# EAGLE design car_onboard (EAGLE 9.6.2)
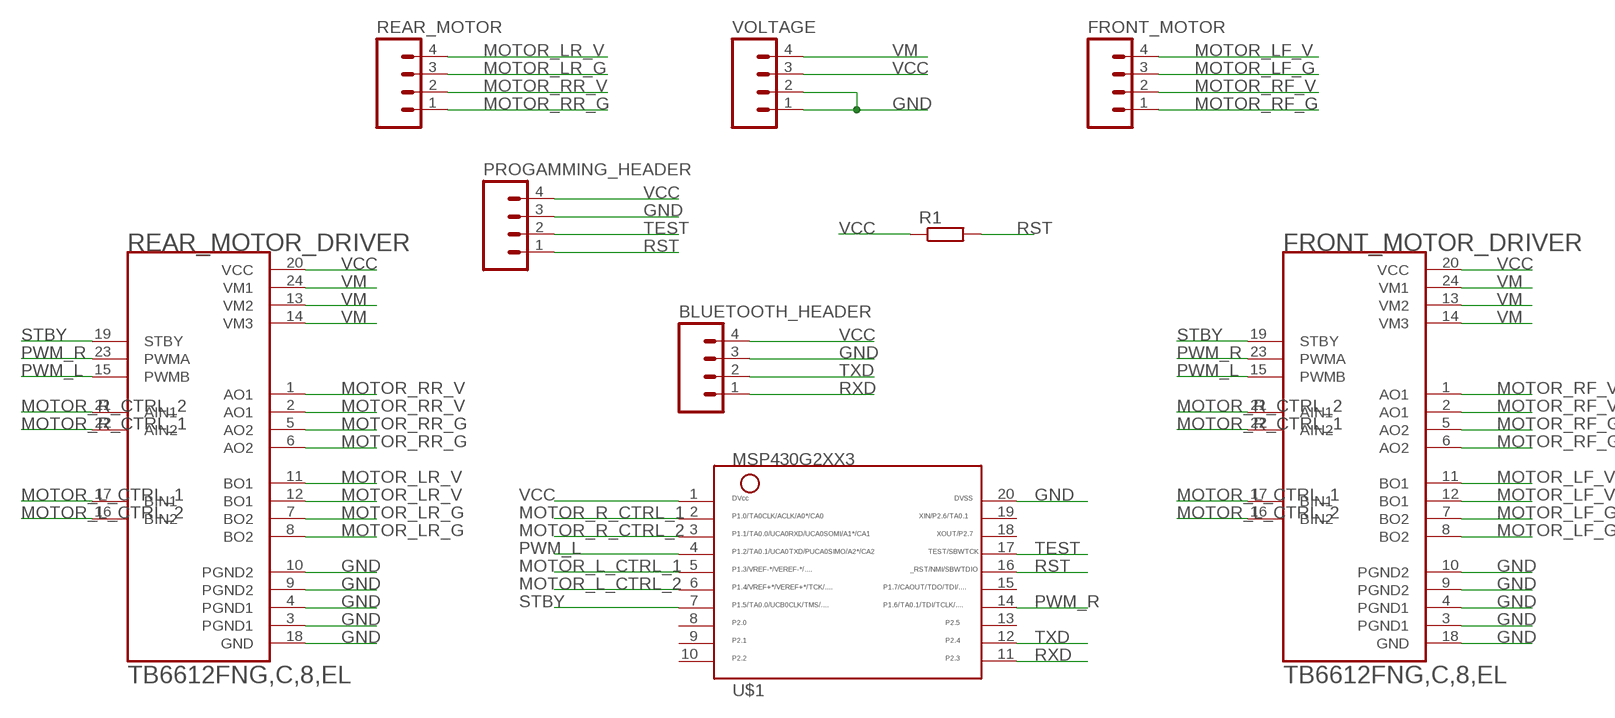
[diagram p0: schematic, sheet 1]

## Parts
BLUETOOTH_HEADER  HEADER_1X04LOCK  [1X04_LOCK]
FRONT_MOTOR  HEADER_1X04LOCK  [1X04_LOCK]
FRONT_MOTOR_DRIVER  TB6612FNG,C,8,EL  [SOP65P760X160-24N]
PROGAMMING_HEADER  HEADER_1X04LOCK  [1X04_LOCK]
R1  R-EU_R1206  [R1206]
REAR_MOTOR  HEADER_1X04LOCK  [1X04_LOCK]
REAR_MOTOR_DRIVER  TB6612FNG,C,8,EL  [SOP65P760X160-24N]
U$1  MSP430G2XX3TSSOP  [PW20]
VOLTAGE  HEADER_1X04LOCK  [1X04_LOCK]

## Nets
GND: BLUETOOTH_HEADER.3 FRONT_MOTOR_DRIVER.3(PGND1) FRONT_MOTOR_DRIVER.4(PGND1) FRONT_MOTOR_DRIVER.9(PGND2) FRONT_MOTOR_DRIVER.10(PGND2) FRONT_MOTOR_DRIVER.18(GND) PROGAMMING_HEADER.3 REAR_MOTOR_DRIVER.3(PGND1) REAR_MOTOR_DRIVER.4(PGND1) REAR_MOTOR_DRIVER.9(PGND2) REAR_MOTOR_DRIVER.10(PGND2) REAR_MOTOR_DRIVER.18(GND) U$1.20 VOLTAGE.1 VOLTAGE.2
MOTOR_L_CTRL_1: FRONT_MOTOR_DRIVER.17(BIN1) REAR_MOTOR_DRIVER.17(BIN1) U$1.5
MOTOR_L_CTRL_2: FRONT_MOTOR_DRIVER.16(BIN2) REAR_MOTOR_DRIVER.16(BIN2) U$1.6
MOTOR_LF_G: FRONT_MOTOR.3 FRONT_MOTOR_DRIVER.7(BO2) FRONT_MOTOR_DRIVER.8(BO2)
MOTOR_LF_V: FRONT_MOTOR.4 FRONT_MOTOR_DRIVER.11(BO1) FRONT_MOTOR_DRIVER.12(BO1)
MOTOR_LR_G: REAR_MOTOR.3 REAR_MOTOR_DRIVER.7(BO2) REAR_MOTOR_DRIVER.8(BO2)
MOTOR_LR_V: REAR_MOTOR.4 REAR_MOTOR_DRIVER.11(BO1) REAR_MOTOR_DRIVER.12(BO1)
MOTOR_R_CTRL_1: FRONT_MOTOR_DRIVER.22(AIN2) REAR_MOTOR_DRIVER.22(AIN2) U$1.2
MOTOR_R_CTRL_2: FRONT_MOTOR_DRIVER.21(AIN1) REAR_MOTOR_DRIVER.21(AIN1) U$1.3
MOTOR_RF_G: FRONT_MOTOR.1 FRONT_MOTOR_DRIVER.5(AO2) FRONT_MOTOR_DRIVER.6(AO2)
MOTOR_RF_V: FRONT_MOTOR.2 FRONT_MOTOR_DRIVER.1(AO1) FRONT_MOTOR_DRIVER.2(AO1)
MOTOR_RR_G: REAR_MOTOR.1 REAR_MOTOR_DRIVER.5(AO2) REAR_MOTOR_DRIVER.6(AO2)
MOTOR_RR_V: REAR_MOTOR.2 REAR_MOTOR_DRIVER.1(AO1) REAR_MOTOR_DRIVER.2(AO1)
PWM_L: FRONT_MOTOR_DRIVER.15(PWMB) REAR_MOTOR_DRIVER.15(PWMB) U$1.4
PWM_R: FRONT_MOTOR_DRIVER.23(PWMA) REAR_MOTOR_DRIVER.23(PWMA) U$1.14
RST: PROGAMMING_HEADER.1 R1.2 U$1.16
RXD: BLUETOOTH_HEADER.1 U$1.11
STBY: FRONT_MOTOR_DRIVER.19(STBY) REAR_MOTOR_DRIVER.19(STBY) U$1.7
TEST: PROGAMMING_HEADER.2 U$1.17
TXD: BLUETOOTH_HEADER.2 U$1.12
VCC: BLUETOOTH_HEADER.4 FRONT_MOTOR_DRIVER.20(VCC) PROGAMMING_HEADER.4 R1.1 REAR_MOTOR_DRIVER.20(VCC) U$1.1 VOLTAGE.3
VM: FRONT_MOTOR_DRIVER.13(VM2) FRONT_MOTOR_DRIVER.14(VM3) FRONT_MOTOR_DRIVER.24(VM1) REAR_MOTOR_DRIVER.13(VM2) REAR_MOTOR_DRIVER.14(VM3) REAR_MOTOR_DRIVER.24(VM1) VOLTAGE.4
Unconnected: U$1.8 U$1.9 U$1.10 U$1.13 U$1.15 U$1.18 U$1.19

## Library data of the parts
BLUETOOTH_HEADER FRONT_MOTOR PROGAMMING_HEADER REAR_MOTOR VOLTAGE = ELEC327:HEADER_1X04: Header 4 Standard 4-pin 0.1" header. Use with straight break away headers (SKU : PRT-00116), right angle break away headers (PRT-00553), swiss pins (PRT-00743), machine pins (PRT-00117), and female headers (PRT-00115). Molex polarized connector foot print use with SKU : PRT-08231 with associated crimp pins and housings.
FRONT_MOTOR_DRIVER REAR_MOTOR_DRIVER = TB6612FNG_C_8_EL:TB6612FNG,C,8,EL: Stepping Motor Driver Ic Unipolor Copper Wire 8" Check availability <https://pricing.snapeda.com/parts/TB6612FNG%2CC%2C8%2CEL/Toshiba/view-part?ref=eda>; AVAILABILITY: In Stock; DESCRIPTION: - Motor Driver Power MOSFET Parallel 24-SSOP; MF: Toshiba; MP: TB6612FNG,C,8,EL; PACKAGE: SSOP-24 Toshiba; PRICE: None; PURCHASE-URL: https://pricing.snapeda.com/search/part/TB6612FNG,C,8,EL/?ref=eda
R1 = rcl:R-EU_: RESISTOR, European symbol; SPICEPREFIX: R
U$1 = ELEC327:MSP430G2XX3: MSP430G2XX3 PDIP (N) 20 Pin Package

## Board
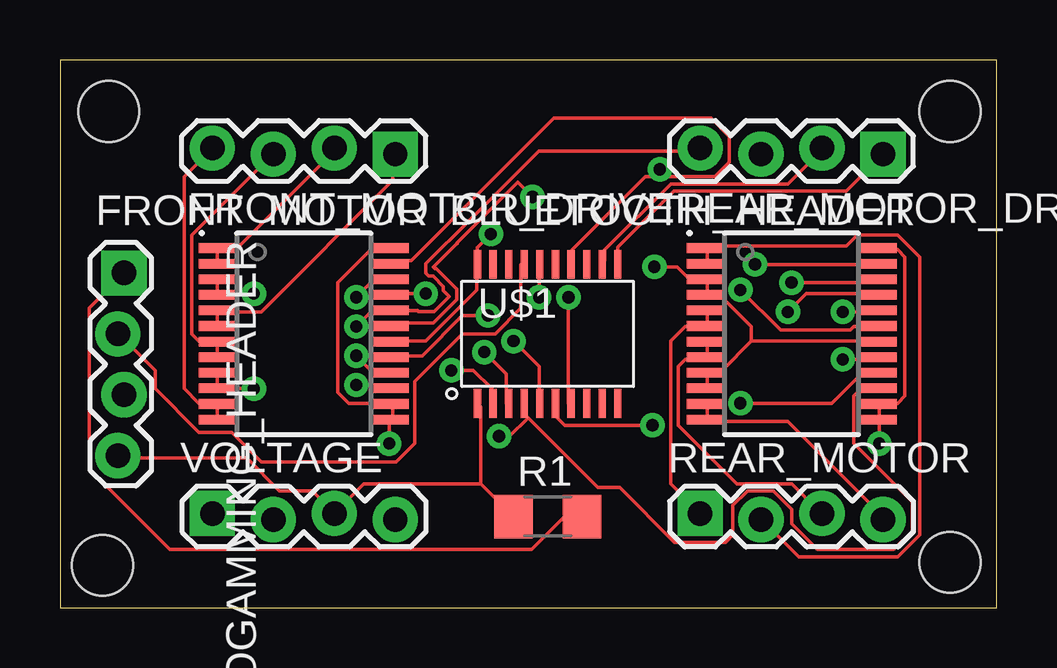
[diagram p1: board, top side]
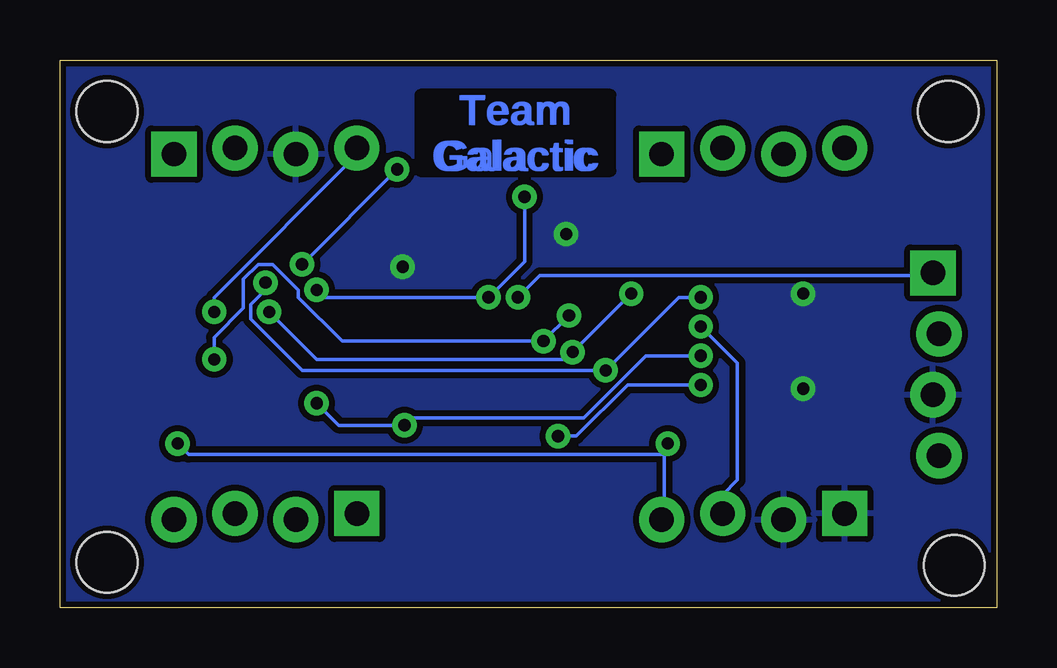
[diagram p2: board, bottom side, seen from below]

Size 39.04 x 22.85 mm. Coordinates in mm from the lower left corner, seen from the top.
Outline: 0,0 39.04,0 39.04,22.85 0,22.85 0,0
Copper layers (1*16): Top 0.035mm / dielectric 1.5mm / Bottom 0.035mm
Design rules "AdvancedCircuitsBarebones": minimum track width 6mil, minimum drill 20mil, track to track 6mil, track to pad 6mil, pad to pad 6mil, via to via 6mil, smd to smd 6mil, copper to edge 10mil, drill to drill 6mil, minimum pad ring 12mil, minimum via ring 10mil, stop-mask expansion 4mil, vias tented up to drill 25mil, thermal gap 10mil
Holes 2.54 mm at 37.08,20.7 37.08,1.91 1.78,1.78 2.03,20.7

### Footprints (pad centres in the part's own frame; a part is rotated, then mirrored left to right if it is on the bottom)
1X04_LOCK = drill 1.016 pad 1.88 square: 1 0,0.127 | drill 1.016 pad 1.88: 2 2.54,-0.127; 3 5.08,0.127; 4 7.62,-0.127
SOP65P760X160-24N = smd 1.5 x 0.4: 1 -3.625,3.575; 2 -3.625,2.925; 3 -3.625,2.275; 4 -3.625,1.625; 5 -3.625,0.975; 6 -3.625,0.325; 7 -3.625,-0.325; 8 -3.625,-0.975; 9 -3.625,-1.625; 10 -3.625,-2.275; 11 -3.625,-2.925; 12 -3.625,-3.575; 13 3.625,-3.575; 14 3.625,-2.925; 15 3.625,-2.275; 16 3.625,-1.625; 17 3.625,-0.975; 18 3.625,-0.325; 19 3.625,0.325; 20 3.625,0.975; 21 3.625,1.625; 22 3.625,2.275; 23 3.625,2.925; 24 3.625,3.575
R1206 = smd 1.6 x 1.803: 1 -1.422,0; 2 1.422,0
PW20 = smd 0.3 x 1.2: 1 -2.925,-2.9; 2 -2.275,-2.9; 3 -1.625,-2.9; 4 -0.975,-2.9; 5 -0.325,-2.9; 6 0.325,-2.9; 7 0.975,-2.9; 8 1.625,-2.9; 9 2.275,-2.9; 10 2.925,-2.9; 11 2.925,2.9; 12 2.275,2.9; 13 1.625,2.9; 14 0.975,2.9; 15 0.325,2.9; 16 -0.325,2.9; 17 -0.975,2.9; 18 -1.625,2.9; 19 -2.275,2.9; 20 -2.925,2.9

### Placement (x,y rotation side)
BLUETOOTH_HEADER  34.29,19.05 180 top
FRONT_MOTOR  13.97,19.05 180 top
FRONT_MOTOR_DRIVER  10.16,11.43 0 top
PROGAMMING_HEADER  2.54,13.97 270 top
R1  20.32,3.81 0 top
REAR_MOTOR  26.67,3.81 0 top
REAR_MOTOR_DRIVER  30.48,11.43 0 top
U$1  20.32,11.43 0 top
VOLTAGE  6.35,3.81 0 top

### Tracks (layer width: path | path; a pad name or v marks a point on that pad's centre or on a via)
GND  (via drill 0.51)
  Top 0.152: REAR_MOTOR_DRIVER.10 26.98,9.3 26.98,9.75 REAR_MOTOR_DRIVER.9 26.98,9.91 27.58,9.91 28.8,11.12 | 28.8,11.12 33.98,11.12 REAR_MOTOR_DRIVER.18 | 28.8,11.12 28.8,11.73 27.58,12.95 26.98,12.95 REAR_MOTOR_DRIVER.4 26.98,13.11 26.98,13.56 REAR_MOTOR_DRIVER.3 26.82,13.67 26.26,13.67 25.71,14.22 v24.77,14.22 | 6.55,13.11 6.55,13.56 FRONT_MOTOR_DRIVER.3 | FRONT_MOTOR_DRIVER.9 6.55,9.75 6.55,9.3 FRONT_MOTOR_DRIVER.10 6.55,9.14 v8.08,9.14 | v8.08,13.11 6.55,13.11 | 6.55,13.11 FRONT_MOTOR_DRIVER.4 | FRONT_MOTOR_DRIVER.18 13.87,11.12 15.24,11.12 17.37,13.26 17.37,14.33 U$1.20 17.39,15.03 v17.95,15.59
  pour Bottom (isolate 0.254): 0,26.67 40.64,26.67 41.91,25.4 41.91,-3.81 40.64,-5.08 0,-5.08
MOTOR_L_CTRL_1  (via drill 0.51)
  Top 0.152: v18.9,11.12 19.96,10.06 19.96,8.53 U$1.5 | v17.83,12.19 16.76,12.19 15.09,10.52 13.87,10.52 FRONT_MOTOR_DRIVER.17 | v32.61,10.36 33.98,10.36 REAR_MOTOR_DRIVER.17
  Bottom 0.152: v17.83,12.19 v18.9,11.12 27.28,11.12 29.11,12.95 29.11,13.26 30.18,14.33 30.79,14.33 31.39,13.72 31.39,12.5 32.61,11.28 v32.61,10.36
MOTOR_L_CTRL_2  (via drill 0.51)
  Top 0.152: v24.69,7.62 21.03,7.62 20.73,7.92 20.73,8.38 U$1.6 | v28.35,8.53 32.16,8.53 33.38,9.75 33.98,9.75 REAR_MOTOR_DRIVER.16 | v12.34,10.52 12.95,9.91 13.72,9.91 FRONT_MOTOR_DRIVER.16
  Bottom 0.152: v28.35,8.53 27.43,7.62 v24.69,7.62 24.38,7.92 17.22,7.92 14.63,10.52 v12.34,10.52
MOTOR_LF_G
  Top 0.152: FRONT_MOTOR_DRIVER.8 6.55,10.52 6.55,10.97 FRONT_MOTOR_DRIVER.7 6.4,11.12 5.79,11.12 5.49,11.43 5.49,15.54 8.84,18.9 FRONT_MOTOR.3
MOTOR_LF_V
  Top 0.152: FRONT_MOTOR_DRIVER.12 6.55,7.92 6.55,8.38 FRONT_MOTOR_DRIVER.11 6.4,8.53 5.79,8.53 5.18,9.14 5.18,17.98 6.25,19.05 FRONT_MOTOR.4
MOTOR_LR_G
  Top 0.152: REAR_MOTOR_DRIVER.7 26.98,10.97 26.98,10.52 REAR_MOTOR_DRIVER.8 26.82,10.36 26.06,10.36 25.76,10.06 25.76,7.62 28.19,5.18 30.48,5.18 31.7,3.96 REAR_MOTOR.3
MOTOR_LR_V
  Top 0.152: REAR_MOTOR_DRIVER.11 26.98,8.38 26.98,7.92 REAR_MOTOR_DRIVER.12 26.98,7.77 30.33,7.77 34.29,3.81 REAR_MOTOR.4
MOTOR_R_CTRL_1  (via drill 0.51)
  Top 0.152: v16.31,9.91 17.22,9.91 17.98,9.14 17.98,8.53 U$1.2 | v12.34,12.95 12.95,13.56 13.72,13.56 FRONT_MOTOR_DRIVER.22 | v30.48,13.56 33.98,13.56 REAR_MOTOR_DRIVER.22
  Bottom 0.152: v12.34,12.95 13.26,12.95 v16.31,9.91 28.96,9.91 31.09,12.04 31.09,12.65 30.48,13.26 v30.48,13.56
MOTOR_R_CTRL_2  (via drill 0.51)
  Top 0.152: v17.68,10.67 18.59,9.75 18.59,8.53 U$1.3 | v15.24,13.11 13.87,13.11 FRONT_MOTOR_DRIVER.21 | v30.33,12.34 31.09,13.11 33.98,13.11 REAR_MOTOR_DRIVER.21
  Bottom 0.152: v15.24,13.11 v17.68,10.67 17.98,10.36 28.35,10.36 v30.33,12.34
MOTOR_RF_G
  Top 0.152: 6.55,12.34 6.55,11.89 FRONT_MOTOR_DRIVER.6 | 6.55,12.34 8.38,12.34 13.87,17.83 13.87,18.9 FRONT_MOTOR.1 | 6.55,12.34 FRONT_MOTOR_DRIVER.5
MOTOR_RF_V
  Top 0.152: FRONT_MOTOR_DRIVER.2 6.55,14.48 6.55,14.94 FRONT_MOTOR_DRIVER.1 6.55,15.09 7.47,15.09 11.43,19.05 FRONT_MOTOR.2
MOTOR_RR_G
  Top 0.152: REAR_MOTOR_DRIVER.5 26.98,12.34 26.98,11.89 REAR_MOTOR_DRIVER.6 26.82,11.73 26.06,11.73 25.45,11.12 25.45,5.18 26.67,3.96 REAR_MOTOR.1
MOTOR_RR_V
  Top 0.152: REAR_MOTOR_DRIVER.2 26.98,14.48 26.98,14.94 REAR_MOTOR_DRIVER.1 26.98,15.09 32.77,15.09 33.22,15.54 34.9,15.54 35.81,14.63 35.81,3.05 34.9,2.13 30.79,2.13 29.26,3.66 REAR_MOTOR.2
PWM_L  (via drill 0.51)
  Top 0.152: 19.51,7.92 22.4,5.03 23.32,5.03 25.6,2.74 27.74,2.74 28.04,3.05 28.04,4.27 28.65,4.88 29.72,4.88 30.48,4.12 30.48,3.5 31.55,2.44 34.75,2.44 35.51,3.2 35.51,4.42 33.07,6.86 33.07,8.84 33.38,9.14 33.98,9.14 REAR_MOTOR_DRIVER.15 | 19.51,7.92 19.36,8.08 19.36,8.38 U$1.4 | v12.34,9.3 13.72,9.3 FRONT_MOTOR_DRIVER.15 | v18.29,7.16 18.75,7.16 19.51,7.92
  Bottom 0.152: v12.34,9.3 15.39,9.3 17.53,7.16 v18.29,7.16
PWM_R  (via drill 0.51)
  Top 0.152: 24.99,17.98 27.28,17.98 27.89,18.59 27.89,19.66 27.13,20.42 20.57,20.42 14.63,14.48 13.87,14.48 FRONT_MOTOR_DRIVER.23 | 24.99,17.98 24.38,17.98 21.34,14.94 21.34,14.48 U$1.14 | v28.96,14.33 33.98,14.33 REAR_MOTOR_DRIVER.23 | 24.99,17.98 v24.99,18.29
  Bottom 0.152: v24.99,18.29 v28.96,14.33
RST  (via drill 0.51)
  Top 0.152: v19.96,12.95 19.96,14.33 U$1.16 | R1.2 21.03,3.81 19.66,2.44 4.57,2.44 1.22,5.79 1.22,12.5 2.59,13.87 PROGAMMING_HEADER.1
  Bottom 0.152: v19.96,12.95 19.05,13.87 2.74,13.87 PROGAMMING_HEADER.1
RXD
  Top 0.152: BLUETOOTH_HEADER.1 34.29,18.9 32.77,17.37 27.94,17.37 27.89,17.37 25.58,17.37 23.25,15.04 U$1.11
STBY  (via drill 0.51)
  Top 0.152: v21.18,12.95 21.18,8.53 U$1.7 | FRONT_MOTOR_DRIVER.19 13.87,11.89 15.54,11.89 16.52,12.87 16.52,13.3 15.67,14.15 15.62,14.15 15.54,14.22 16.52,15.2 16.55,15.2 16.55,15.23 19.07,17.75 v19.68,17.14 | v28.35,13.26 30.02,11.58 32.92,11.58 33.07,11.73 33.98,11.73 REAR_MOTOR_DRIVER.19
  Bottom 0.152: v28.35,13.26 28.04,12.95 v21.18,12.95 19.68,14.45 v19.68,17.14
TEST
  Top 0.152: U$1.17 19.2,14.33 19.2,12.5 18.14,11.43 16.76,11.43 14.78,9.45 14.78,6.86 14.02,6.1 8.38,6.1 7.16,7.32 5.79,7.32 3.96,9.14 3.96,9.91 2.44,11.43 PROGAMMING_HEADER.2
TXD
  Top 0.152: U$1.12 22.71,14.48 22.71,14.94 25.45,17.68 30.33,17.68 31.7,19.05 BLUETOOTH_HEADER.2
VCC  (via drill 0.51)
  Top 0.152: 17.53,5.18 17.53,8.38 U$1.1 | R1.1 17.53,5.18 | R1.1 | 17.53,5.18 12.65,5.18 11.43,3.96 | 11.43,3.96 10.52,4.88 9.14,4.88 7.77,6.25 2.44,6.25 PROGAMMING_HEADER.4 | 11.43,3.96 VOLTAGE.3 | BLUETOOTH_HEADER.4 26.67,19.05 19.94,19.05 16.32,15.43 15.98,15.09 15.24,14.35 15.24,13.97 15.37,13.84 15.54,13.84 15.98,13.41 15.98,13.23 16.22,12.99 15.6,12.37 14.94,12.37 14.9,12.4 FRONT_MOTOR_DRIVER.20 13.72,12.34 12.95,12.34 v12.34,11.73 | v32.61,12.34 33.98,12.34 REAR_MOTOR_DRIVER.20
  Bottom 0.152: v32.61,12.34 32.61,12.95 26.67,18.9 BLUETOOTH_HEADER.4 | VOLTAGE.3 11.43,4.72 10.82,5.33 10.82,10.21 v12.34,11.73
VM  (via drill 0.51)
  Top 0.152: REAR_MOTOR_DRIVER.24 34.14,14.94 34.9,14.94 35.2,14.63 35.2,8.84 34.9,8.53 34.14,8.53 REAR_MOTOR_DRIVER.14 34.14,8.38 34.14,7.92 REAR_MOTOR_DRIVER.13 34.14,7.77 v34.14,6.86 | FRONT_MOTOR_DRIVER.24 13.72,14.94 12.95,14.94 11.58,13.56 11.58,8.99 12.04,8.53 13.72,8.53 FRONT_MOTOR_DRIVER.14 13.87,8.38 13.87,7.92 FRONT_MOTOR_DRIVER.13 13.72,7.77 v13.72,6.86
  Bottom 0.152: 13.87,6.4 13.87,6.71 v13.72,6.86 13.87,6.4 | 13.87,6.4 13.87,3.81 VOLTAGE.4 | v34.14,6.86 33.68,6.4 13.87,6.4

### Text on the board
Bottom: Team / Galactic | Team / Galactic | Team / Galactic | Team / Galactic | Team / Galactic | Team / Galactic | Team / Galactic